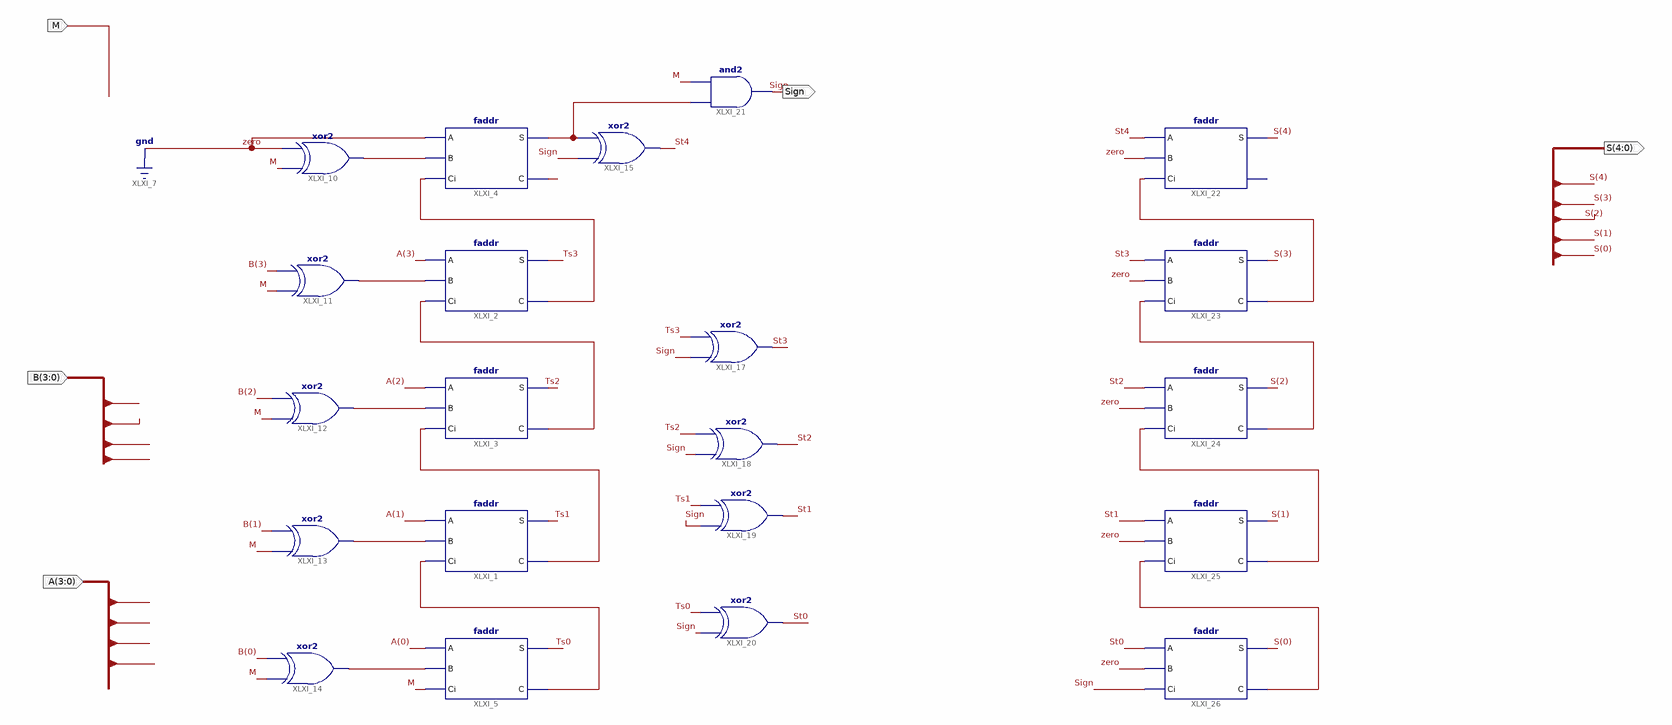
[diagram p0: schematic sheet 1]
// Xilinx ISE schematic addr4bit.sch (artix7) as structural Verilog: 21 symbols, 5 ports
module addr4bit (
  input  [3:0] A,
  input  M,
  input  [3:0] B,
  output Sign,
  output [4:0] S
);

  wire C5o, St0, St1, St2, St3, St4, Ts0, Ts1, Ts2, Ts3, XLXN_3, XLXN_4, XLXN_5, XLXN_6, XLXN_9, XLXN_10,
       XLXN_11, XLXN_12, XLXN_13, XLXN_50, XLXN_53, XLXN_54, XLXN_55, XLXN_56;

  faddr XLXI_1 (.A(A[1]), .B(XLXN_12), .Ci(XLXN_6), .S(Ts1), .C(XLXN_5));
  faddr XLXI_2 (.A(A[3]), .B(XLXN_10), .Ci(XLXN_4), .S(Ts3), .C(XLXN_3));
  faddr XLXI_3 (.A(A[2]), .B(XLXN_11), .Ci(XLXN_5), .S(Ts2), .C(XLXN_4));
  faddr XLXI_4 (.A(1'b0), .B(XLXN_9), .Ci(XLXN_3), .S(XLXN_50), .C(C5o));
  faddr XLXI_5 (.A(A[0]), .B(XLXN_13), .Ci(M), .S(Ts0), .C(XLXN_6));
  xor XLXI_10 (XLXN_9, M, 1'b0);
  xor XLXI_11 (XLXN_10, M, B[3]);
  xor XLXI_12 (XLXN_11, M, B[2]);
  xor XLXI_13 (XLXN_12, M, B[1]);
  xor XLXI_14 (XLXN_13, M, B[0]);
  xor XLXI_15 (St4, Sign, XLXN_50);
  xor XLXI_17 (St3, Sign, Ts3);
  xor XLXI_18 (St2, Sign, Ts2);
  xor XLXI_19 (St1, Sign, Ts1);
  xor XLXI_20 (St0, Sign, Ts0);
  and XLXI_21 (Sign, XLXN_50, M);
  faddr XLXI_22 (.A(St4), .B(1'b0), .Ci(XLXN_53), .S(S[4]));  // open: C
  faddr XLXI_23 (.A(St3), .B(1'b0), .Ci(XLXN_54), .S(S[3]), .C(XLXN_53));
  faddr XLXI_24 (.A(St2), .B(1'b0), .Ci(XLXN_55), .S(S[2]), .C(XLXN_54));
  faddr XLXI_25 (.A(St1), .B(1'b0), .Ci(XLXN_56), .S(S[1]), .C(XLXN_55));
  faddr XLXI_26 (.A(St0), .B(1'b0), .Ci(Sign), .S(S[0]), .C(XLXN_56));
endmodule
